# EAGLE design EHDD_LAB_2 (EAGLE 7.7.0)
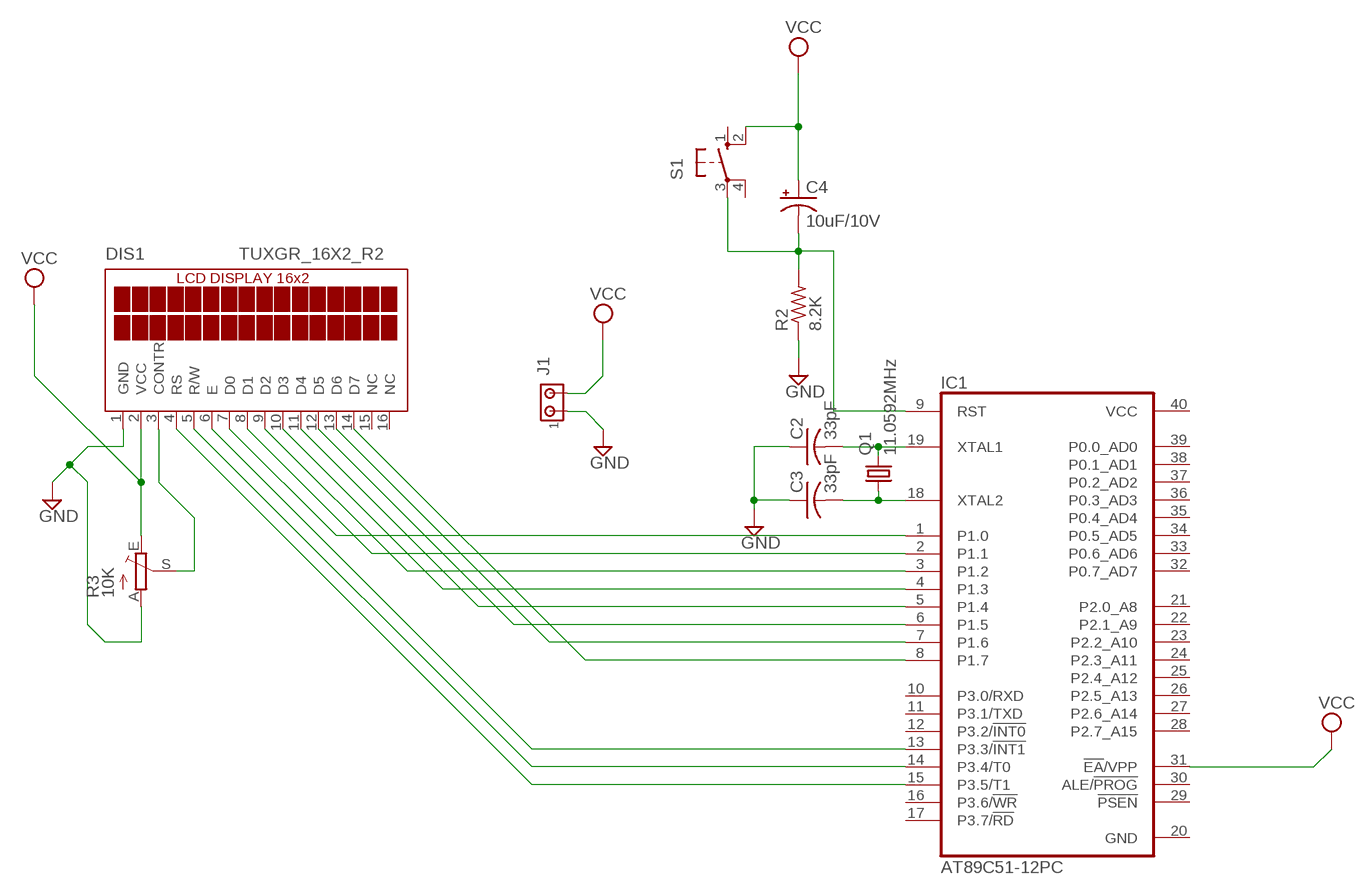
[diagram p0: schematic, sheet 1]

## Parts
C2  33pF  C-US025-025X050  [C025-025X050]
C3  33pF  C-US025-025X050  [C025-025X050]
C4  10uF/10V  CPOL-USE2.5-5  [E2,5-5]
DIS1  TUXGR_16X2_R2  [TUXGR_16X2_R2]
IC1  AT89C51-12PC  [DIL40]
J1  MTA02-100  [10X02MTA]
Q1  11.0592MHz  CRYSTALTC26H  [TC26H]
R2  8.2K  R-US_R2512  [R2512]
R3  10K  TRIM_EU-B25U  [B25U]
S1  10-XX  [B3F-10XX]

## Nets
GND: C2.1 C3.1 DIS1.1(GND) J1.1 R2.1 R3.A
N$1: C4.- IC1.9(RST) R2.2 S1.3(P)
N$3: C2.2 IC1.19(XTAL1) Q1.2
N$4: C3.2 IC1.18(XTAL2) Q1.1
N$7: DIS1.7(D0) IC1.1(P1.0)
N$8: DIS1.8(D1) IC1.2(P1.1)
N$9: DIS1.9(D2) IC1.3(P1.2)
N$10: DIS1.10(D3) IC1.4(P1.3)
N$11: DIS1.11(D4) IC1.5(P1.4)
N$12: DIS1.12(D5) IC1.6(P1.5)
N$13: DIS1.13(D6) IC1.7(P1.6)
N$14: DIS1.14(D7) IC1.8(P1.7)
N$15: DIS1.6(E) IC1.13(P3.3/!INT1)
N$16: DIS1.5(R/W) IC1.14(P3.4/T0)
N$17: DIS1.4(RS) IC1.15(P3.5/T1)
N$19: DIS1.3(CONTR) R3.S
VCC: C4.+ DIS1.2(VCC) IC1.31(!EA!/VPP) J1.2 R3.E S1.2(S1)
Unconnected: DIS1.15(NC) DIS1.16(NC) IC1.10(P3.0/RXD) IC1.11(P3.1/TXD) IC1.12(P3.2/!INT0) IC1.16(P3.6/!WR) IC1.17(P3.7/!RD) IC1.21(P2.0_A8) IC1.22(P2.1_A9) IC1.23(P2.2_A10) IC1.24(P2.3_A11) IC1.25(P2.4_A12) IC1.26(P2.5_A13) IC1.27(P2.6_A14) IC1.28(P2.7_A15) IC1.29(!PSEN) IC1.30(ALE/!PROG) IC1.32(P0.7_AD7) IC1.33(P0.6_AD6) IC1.34(P0.5_AD5) IC1.35(P0.4_AD4) IC1.36(P0.3_AD3) IC1.37(P0.2_AD2) IC1.38(P0.1_AD1) IC1.39(P0.0_AD0) S1.1(S) S1.4(P1)

## Power pins joined to a net without a drawn wire
GND: IC1.20(GND)
VCC: IC1.40(VCC)

## Library data of the parts
C2 C3 = resistor:C-US: CAPACITOR, American symbol
C4 = rcl:CPOL-US: POLARIZED CAPACITOR, American symbol
DIS1 = display-lcd:TUXGR_16X2_R2: Tuxgraphics LCD display 16x2 characters reflective, without background light Source: tuxgr_12x2_r2.pdf; OC_FARNELL: unknown; OC_NEWARK: unknown
IC1 = atmel:AT89C51-*: 8-bit Microcontroller with 4K Bytes Flash Not Recommended for New Designs. Use AT89S51. Source: http://www.atmel.com/dyn/resources/prod_documents/doc0265.; OC_FARNELL: unknown; OC_NEWARK: unknown
J1 = con-amp:MTA02-100: AMP connector
Q1 = crystal:CRYSTAL: CRYSTAL; OC_FARNELL: unknown; OC_NEWARK: unknown
R2 = rcl:R-US_: RESISTOR, American symbol
R3 = pot:TRIM_EU-: POTENTIOMETER
S1 = switch-omron:10-XX: OMRON SWITCH; MPN: B3F-1000; OC_FARNELL: 176432; OC_NEWARK: 36M3542

## Board
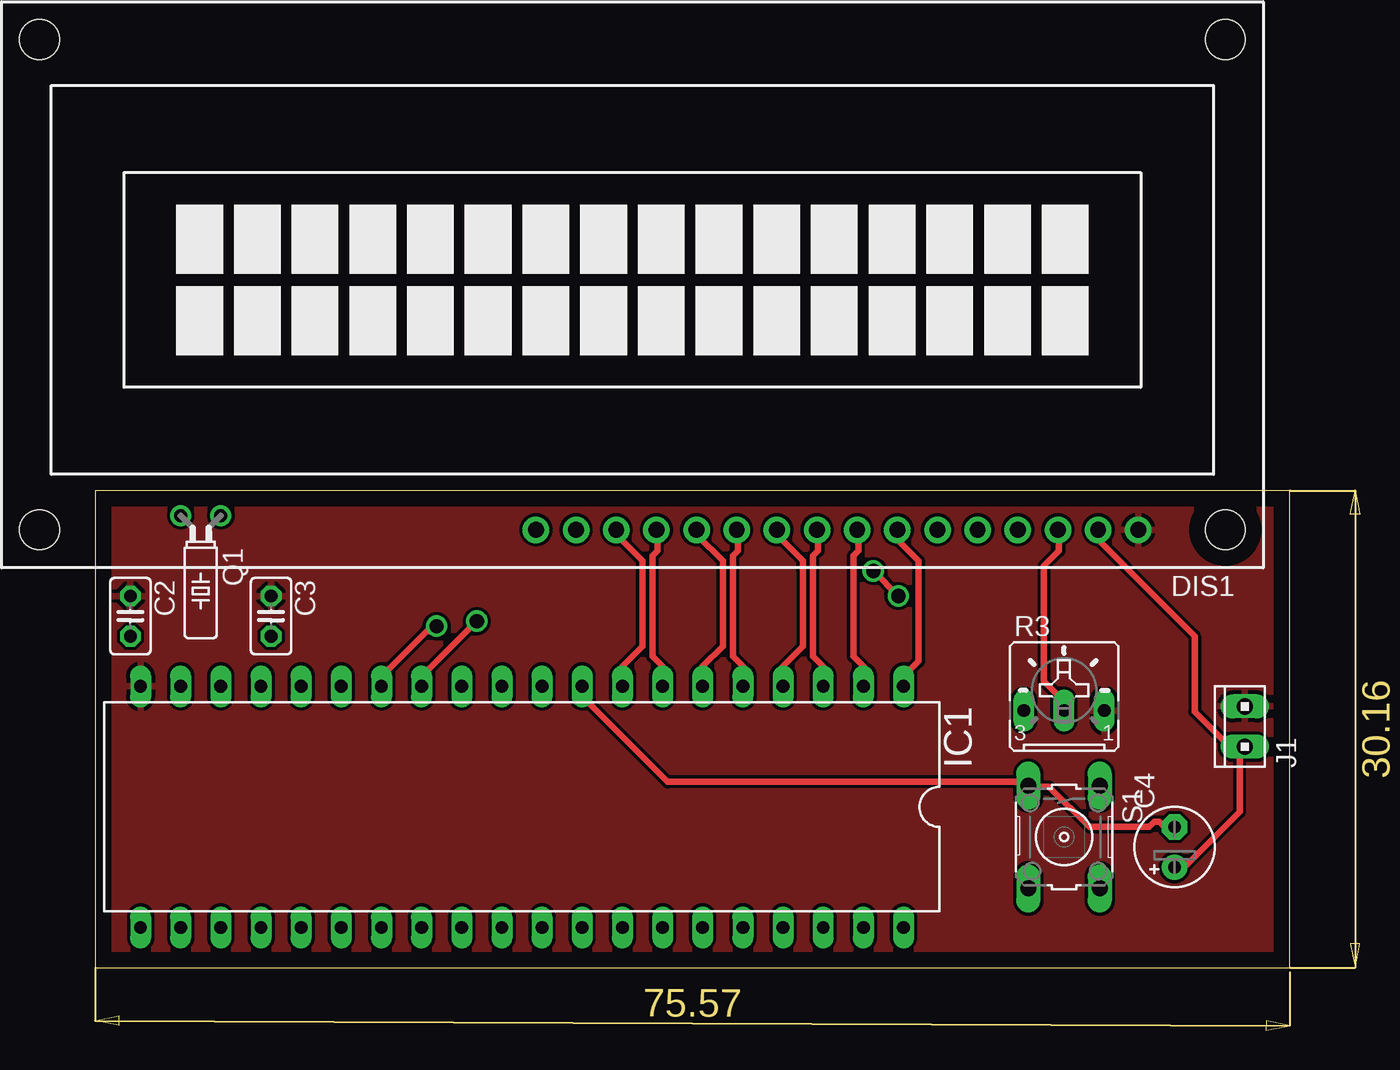
[diagram p1: board, top side]
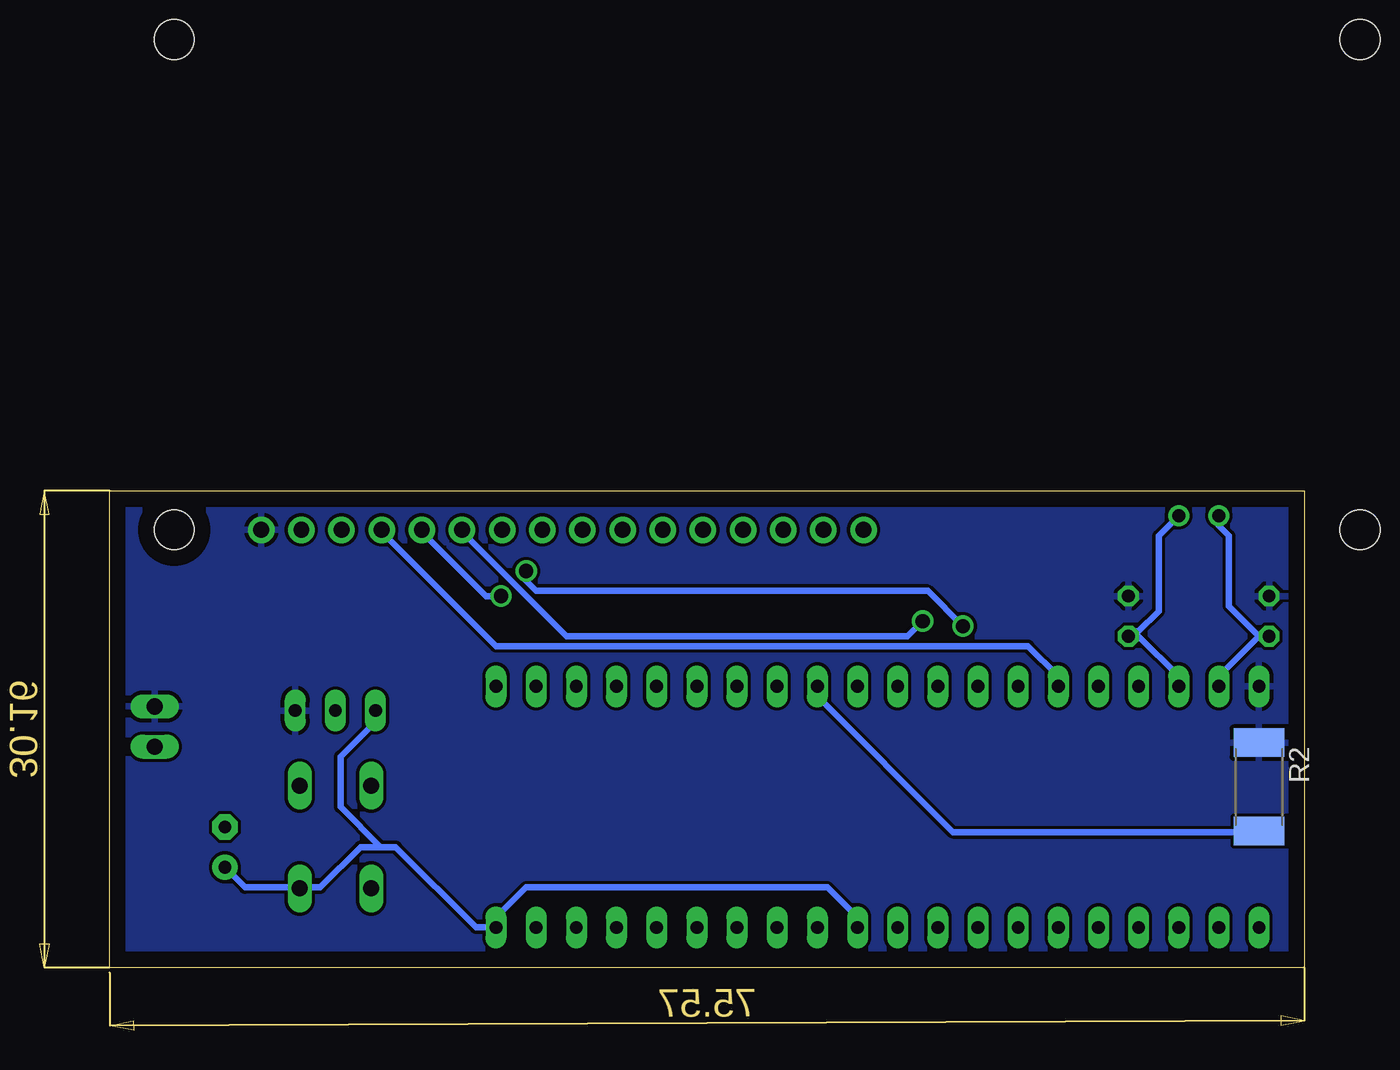
[diagram p2: board, bottom side, seen from below]

Size 75.55 x 30.15 mm. Coordinates in mm from the lower left corner, seen from the top.
Outline: 0,0 75.55,0 75.55,30.15 0,30.15 0,0
Copper layers (1*16): Top 0.035mm / dielectric 1.5mm / Bottom 0.035mm
Design rules "default": minimum track width 10mil, minimum drill 24mil, track to track 8mil, track to pad 8mil, pad to pad 8mil, via to via 8mil, smd to smd 8mil, copper to edge 40mil, drill to drill 8mil, minimum pad ring 10mil, minimum via ring 8mil, stop-mask expansion 4mil, vias tented up to drill 0mil, thermal gap 10mil

### Footprints (pad centres in the part's own frame; a part is rotated, then mirrored left to right if it is on the bottom)
C025-025X050 = drill 0.813 octagon: 1 -1.27,0; 2 1.27,0
E2,5-5 = drill 0.813 pad 1.6: + -1.27,0 | drill 0.813 pad 1.6 octagon: - 1.27,0
TUXGR_16X2_R2 = drill 1 pad 1.676: 1 -32,15.5; 2 -29.46,15.5; 3 -26.92,15.5; 4 -24.38,15.5; 5 -21.84,15.5; 6 -19.3,15.5; 7 -16.76,15.5; 8 -14.22,15.5; 9 -11.68,15.5; 10 -9.14,15.5; 11 -6.6,15.5; 12 -4.06,15.5; 13 -1.52,15.5; 14 1.02,15.5; 15 3.56,15.5; 16 6.1,15.5 | hole 2.5: -37.5,-15.5; 37.5,-15.5; -37.5,15.5; 37.5,15.5
DIL40 = drill 0.813 long: 1 -24.13,-7.62; 2 -21.59,-7.62; 3 -19.05,-7.62; 4 -16.51,-7.62; 5 -13.97,-7.62; 6 -11.43,-7.62; 7 -8.89,-7.62; 8 -6.35,-7.62; 9 -3.81,-7.62; 10 -1.27,-7.62; 11 1.27,-7.62; 12 3.81,-7.62; 13 6.35,-7.62; 14 8.89,-7.62; 15 11.43,-7.62; 16 13.97,-7.62; 17 16.51,-7.62; 18 19.05,-7.62; 19 21.59,-7.62; 20 24.13,-7.62; 21 24.13,7.62; 22 21.59,7.62; 23 19.05,7.62; 24 16.51,7.62; 25 13.97,7.62; 26 11.43,7.62; 27 8.89,7.62; 28 6.35,7.62; 29 3.81,7.62; 30 1.27,7.62; 31 -1.27,7.62; 32 -3.81,7.62; 33 -6.35,7.62; 34 -8.89,7.62; 35 -11.43,7.62; 36 -13.97,7.62; 37 -16.51,7.62; 38 -19.05,7.62; 39 -21.59,7.62; 40 -24.13,7.62
10X02MTA = drill 1.016 long: 1 1.27,0; 2 -1.27,0
TC26H = drill 0.813: 1 -1.27,0; 2 1.27,0
R2512 = smd 1.8 x 3.2: 1 -2.8,0; 2 2.8,0
B25U = drill 0.813 long: A 2.54,-0.889; E -2.54,-0.889; S 0,-0.889
B3F-10XX = drill 1.016 long: 1 -3.251,2.261; 2 3.251,2.261; 3 -3.251,-2.261; 4 3.251,-2.261

### Placement (x,y rotation side)
C2  2.22,22.23 270 top
C3  11.11,22.23 270 top
C4  68.26,7.62 90 top
DIS1  33.97,43.18 180 top
IC1  26.99,10.16 180 top
J1  72.71,15.24 90 top
Q1  6.67,28.57 180 top
R2  2.86,11.43 270 bottom
R3  61.28,17.14 0 top
S1  61.28,8.26 270 top

### Tracks (layer width: path | path; a pad name or v marks a point on that pad's centre or on a via)
GND
  pour Bottom: 0,0 75.56,-0.32 75.56,30.16 -0.32,30.48
  pour Top: -0.32,30.48 75.56,30.48 75.56,0 0,0
N$1
  Top 0.406: IC1.9 30.8,17.14 36.2,11.75 58.74,11.75 S1.3 59.05,11.43 60.33,11.43 62.87,8.89 66.67,8.89 66.99,9.21 67.31,9.21 67.63,8.89 C4.-
  Bottom 0.406: IC1.9 30.8,17.14 22.23,8.57 2.86,8.57 R2.2
N$3
  Bottom 0.406: IC1.19 5.4,18.41 2.86,20.95 | 2.86,20.95 4.76,22.86 4.76,27.3 5.4,27.94 Q1.2 | 2.86,20.95 C2.2
N$4
  Bottom 0.406: IC1.18 7.94,18.41 10.48,20.95 C3.2 10.79,21.27 10.48,21.27 9.21,22.54 9.21,27.3 Q1.1
N$7
  Top 0.406: IC1.1 51.12,18.41 52.07,19.37 52.07,25.72 50.8,26.99 50.8,27.62 DIS1.7
N$8
  Top 0.406: IC1.2 48.58,19.05 47.94,19.68 47.94,26.04 48.26,26.35 48.26,27.62 DIS1.8
N$9
  Top 0.406: IC1.3 46.04,19.05 45.4,19.68 45.4,26.04 45.72,26.35 45.72,27.62 DIS1.9
N$10
  Top 0.406: IC1.4 43.5,19.05 44.77,20.32 44.77,25.72 43.18,27.3 43.18,27.62 DIS1.10
N$11
  Top 0.406: IC1.5 40.96,19.05 40.32,19.68 40.32,26.04 40.64,26.35 40.64,27.62 DIS1.11
N$12
  Top 0.406: IC1.6 38.42,19.05 39.69,20.32 39.69,25.72 38.1,27.3 38.1,27.62 DIS1.12
N$13
  Top 0.406: IC1.7 35.88,19.05 35.24,19.68 35.24,26.04 35.56,26.35 35.56,27.62 DIS1.13
N$14
  Top 0.406: IC1.8 33.34,19.05 34.61,20.32 34.61,25.72 33.02,27.3 33.02,27.62 DIS1.14
N$15  (via drill 0.9)
  Top 0.406: v24.13,21.91 20.64,18.41 IC1.13
  Bottom 0.406: v24.13,21.91 25.08,20.95 46.67,20.95 53.02,27.3 53.02,27.62 DIS1.6
N$16  (via drill 0.9)
  Top 0.406: v50.8,23.5 v49.21,25.08 | v21.59,21.59 21.27,21.27 20.95,21.27 18.1,18.41 IC1.14
  Bottom 0.406: v49.21,25.08 49.21,24.45 48.58,23.81 23.81,23.81 v21.59,21.59 | v50.8,23.5 51.75,23.5 55.88,27.62 DIS1.5
N$17
  Bottom 0.406: IC1.15 15.56,18.41 17.46,20.32 51.12,20.32 58.1,27.3 58.1,27.62 DIS1.4
N$19
  Top 0.406: R3.S 61.28,16.83 60.01,18.1 60.01,25.4 60.96,26.35 60.96,27.62 DIS1.3
VCC
  Top 0.406: DIS1.2 63.5,27.62 63.5,26.99 69.53,20.95 69.53,16.19 71.75,13.97 72.39,13.97 | 72.39,13.97 72.39,9.84 68.9,6.35 C4.+ | 72.39,13.97 J1.2
  Bottom 0.406: IC1.31 28.26,3.17 30.16,5.08 49.21,5.08 51.12,3.17 IC1.40 52.39,2.54 57.47,7.62 58.42,7.62 | 58.42,7.62 59.69,7.62 62.23,5.08 63.5,5.08 S1.2 63.82,5.08 66.99,5.08 C4.+ | R3.E 58.74,15.56 60.96,13.34 60.96,10.16 58.42,7.62